# EAGLE design SHIELDV1_NANO (EAGLE 9.5.2)
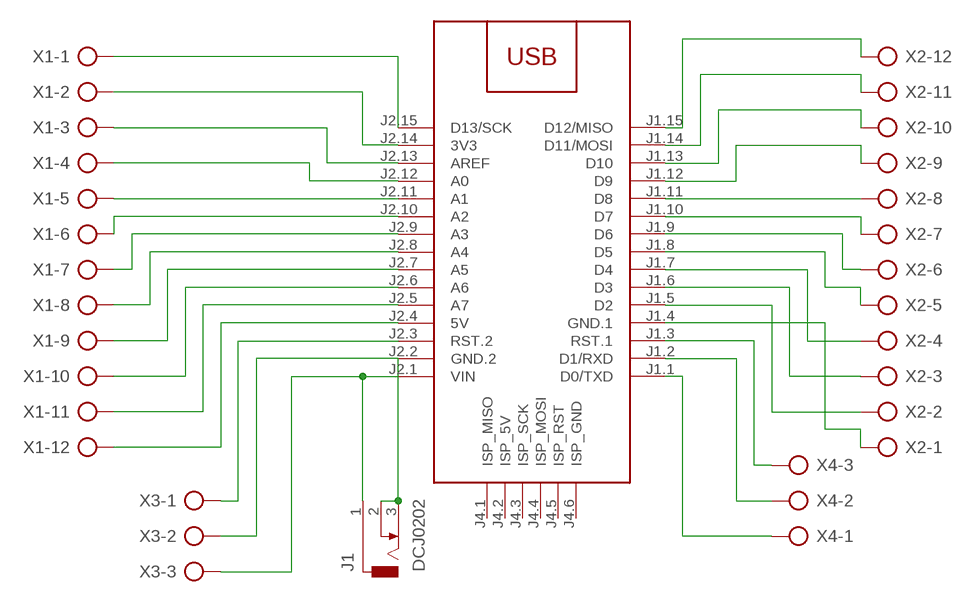
[diagram p0: schematic, sheet 1]

## Parts
J1  DCJ0202  [DCJ0202]
M1  ARDUINO-NANO-3.0#ISP  [ARDUINO-NANO-3.0#ISP]
X1  AK500/12-H  [AK500/12-H]
X2  AK500/12-H  [AK500/12-H]
X3  AK500/3  [AK500/3]
X4  AK500/3  [AK500/3]

## Nets
N$1: M1.J2.15(D13/SCK) X1.1
N$2: M1.J2.14(3V3) X1.2
N$3: M1.J2.13(AREF) X1.3
N$4: M1.J2.12(A0) X1.4
N$5: M1.J2.11(A1) X1.5
N$6: M1.J2.10(A2) X1.6
N$7: M1.J2.9(A3) X1.7
N$8: M1.J2.8(A4) X1.8
N$9: M1.J2.7(A5) X1.9
N$10: M1.J2.6(A6) X1.10
N$11: M1.J2.5(A7) X1.11
N$12: M1.J2.4(5V) X1.12
N$13: M1.J1.15(D12/MISO) X2.12
N$14: M1.J1.14(D11/MOSI) X2.11
N$15: M1.J1.13(D10) X2.10
N$16: M1.J1.12(D9) X2.9
N$17: M1.J1.11(D8) X2.8
N$18: M1.J1.10(D7) X2.7
N$19: M1.J1.9(D6) X2.6
N$20: M1.J1.8(D5) X2.5
N$21: M1.J1.7(D4) X2.4
N$22: M1.J1.6(D3) X2.3
N$23: M1.J1.5(D2) X2.2
N$24: M1.J1.4(GND.1) X2.1
N$25: M1.J2.3(RST.2) X3.1
N$27: J1.1 M1.J2.1(VIN) X3.3
N$28: M1.J1.3(RST.1) X4.3
N$29: M1.J1.2(D1/RXD) X4.2
N$30: M1.J1.1(D0/TXD) X4.1
N$31: J1.2 J1.3 M1.J2.2(GND.2) X3.2
Unconnected: M1.J4.1(ISP_MISO) M1.J4.2(ISP_5V) M1.J4.3(ISP_SCK) M1.J4.4(ISP_MOSI) M1.J4.5(ISP_RST) M1.J4.6(ISP_GND)

## Library data of the parts
J1 = con-jack:DCJ0202: DC POWER JACK Source: DCJ0202.pdf; OC_FARNELL: unknown; OC_NEWARK: unknown
M1 = ARDUINO MODULOS:ARDUINO-NANO-3.0#ISP: Arduino Nano 3.0 with ISP pads
X1 X2 = con-ptr500:AK500/12-H: CONNECTOR Aug. 2004 / PTR Meßtechnik: Die Bezeichnung der Serie AK505 wurde geändert. Es handelt sich hierbei um AK500 in horizontaler Ausführung.; OC_FARNELL: unknown; OC_NEWARK: unknown
X3 X4 = con-ptr500:AK500/3: CONNECTOR; OC_FARNELL: unknown; OC_NEWARK: unknown

## Board
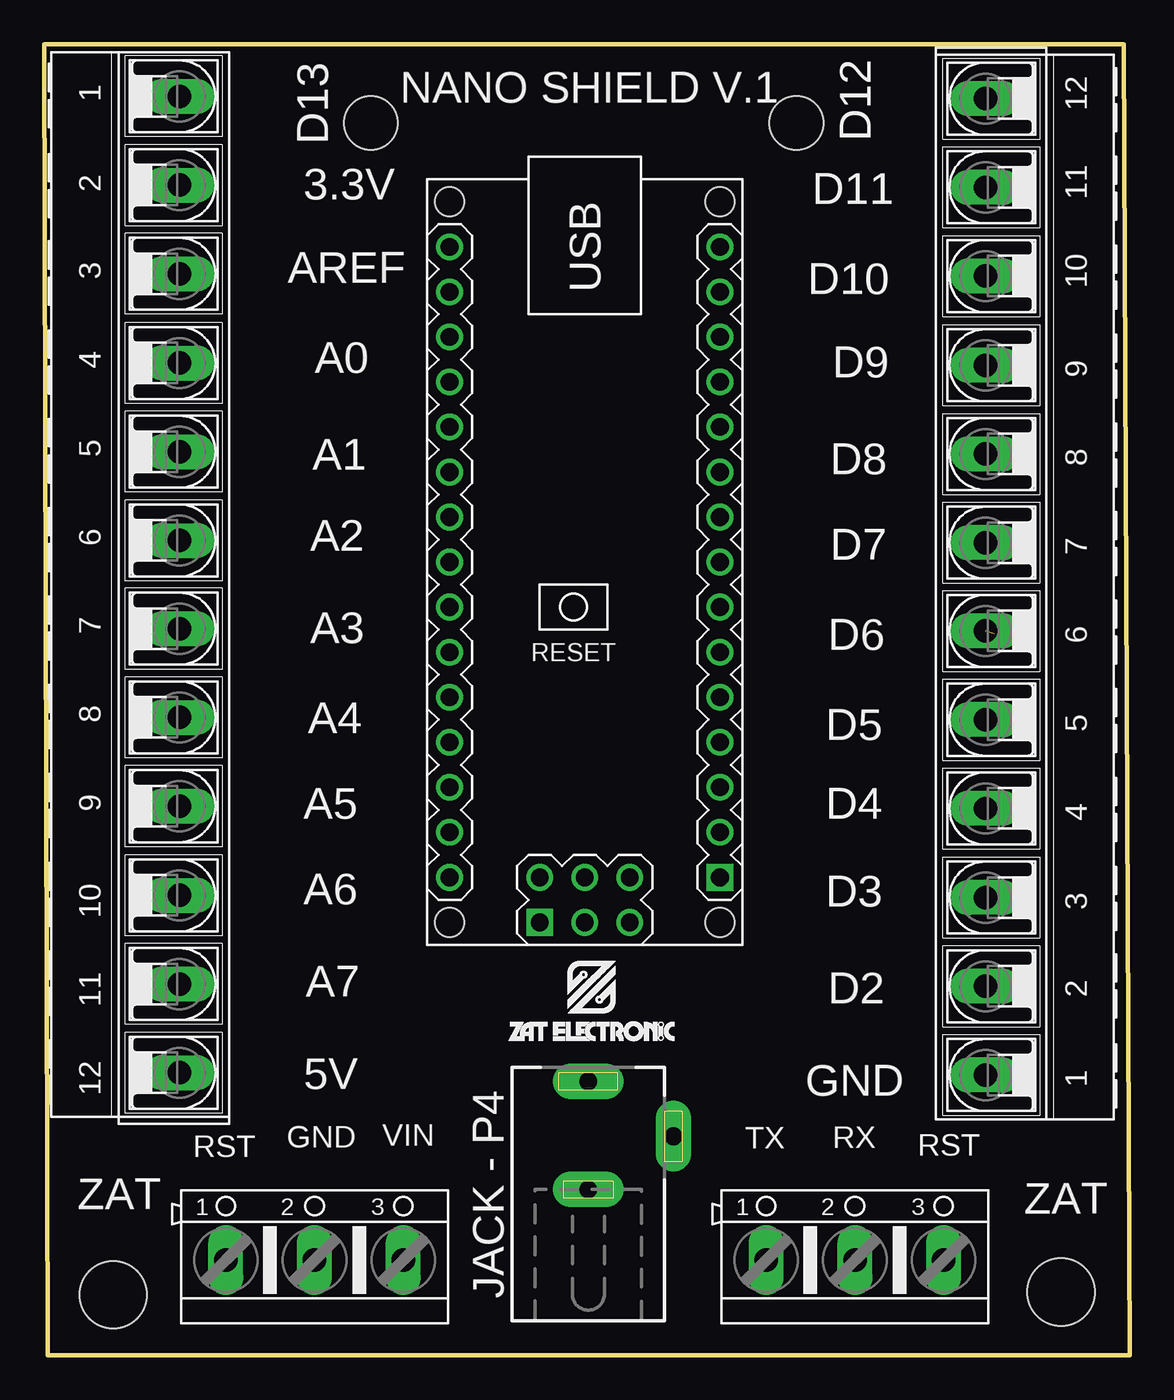
[diagram p1: board, top side]
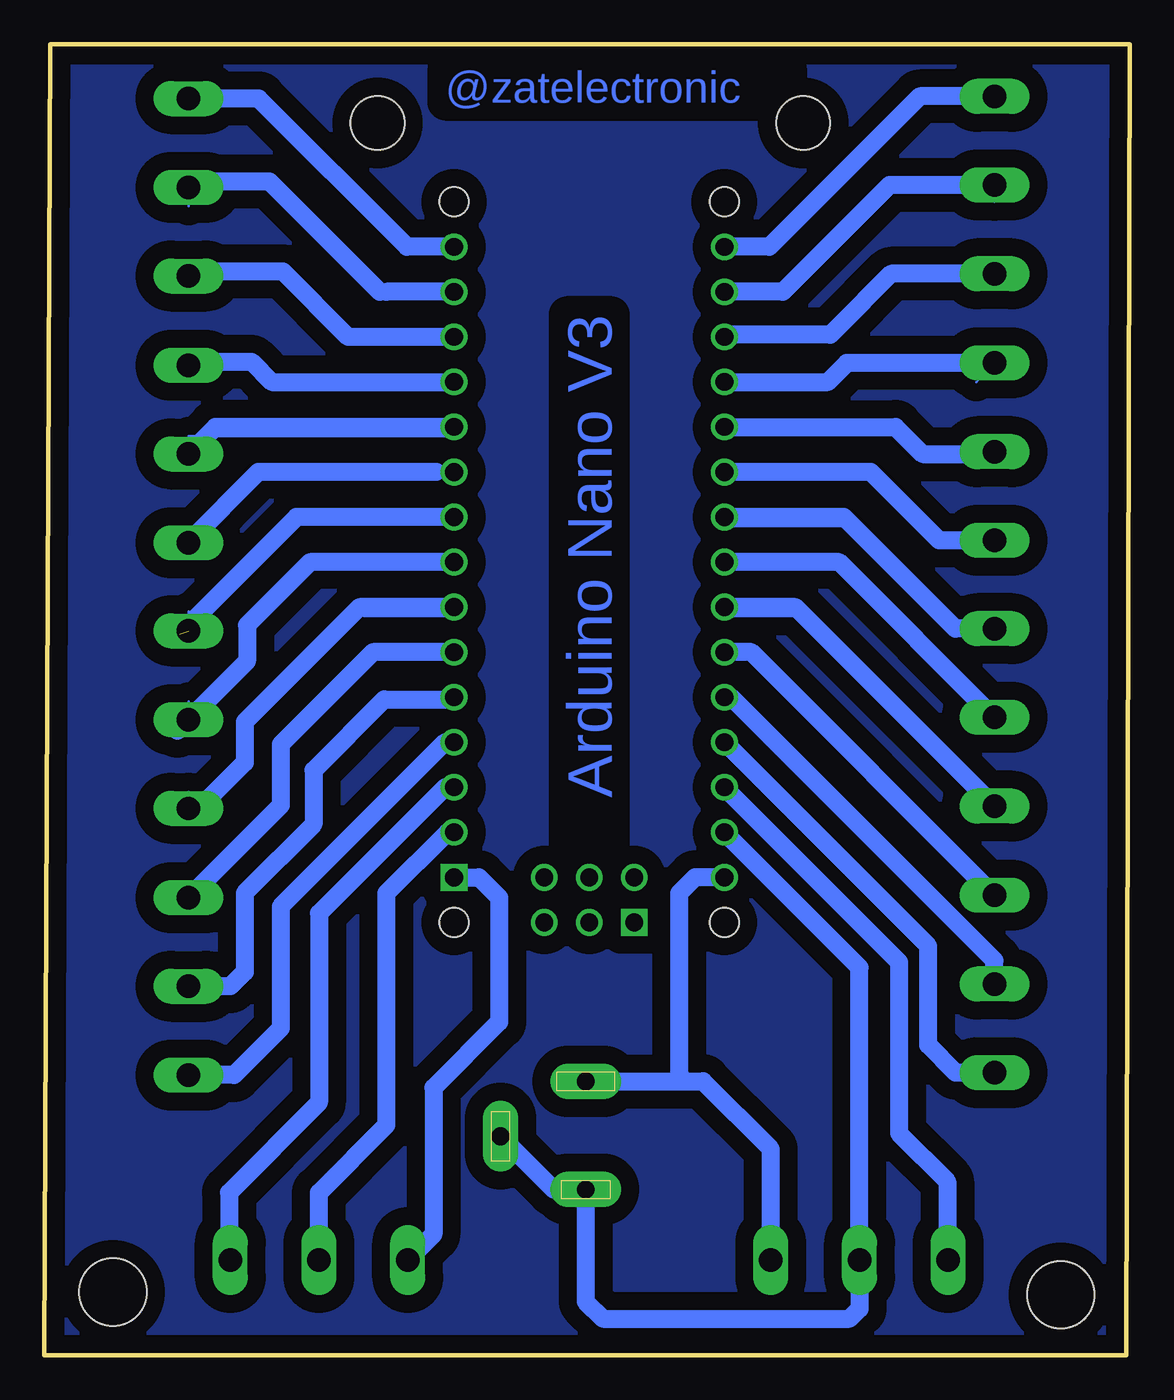
[diagram p2: board, bottom side, seen from below]

Size 61.21 x 73.93 mm. Coordinates in mm from the lower left corner, seen from the top.
Outline: 0.2,0 61.21,0 60.88,73.93 0,73.93 0.2,0
Copper layers (1*16): Top 0.035mm / dielectric 1.5mm / Bottom 0.035mm
Design rules "default": minimum track width 6mil, minimum drill 0.35mm, track to track 6mil, track to pad 6mil, pad to pad 6mil, via to via 6mil, smd to smd 6mil, copper to edge 40mil, drill to drill 6mil, minimum pad ring 10mil, minimum via ring 8mil, stop-mask expansion 4mil, vias tented up to drill 0mil, thermal gap 10mil
Holes 3.81 mm at 3.89,3.4 57.35,3.56
Holes 3.05 mm at 18.41,69.49 42.42,69.49

### Footprints (pad centres in the part's own frame; a part is rotated, then mirrored left to right if it is on the bottom)
DCJ0202 = drill 1 pad 2 long: 1 0,3.1; 2 4.8,0; 3 0,-3
ARDUINO-NANO-3.0#ISP = drill 1 square: J1.1 17.78,7.62; J4.1 20.32,-2.54 | drill 1: J1.2 15.24,7.62; J1.3 12.7,7.62; J1.4 10.16,7.62; J1.5 7.62,7.62; J1.6 5.08,7.62; J1.7 2.54,7.62; J1.8 0,7.62; J1.9 -2.54,7.62; J1.10 -5.08,7.62; J1.11 -7.62,7.62; J1.12 -10.16,7.62; J1.13 -12.7,7.62; J1.14 -15.24,7.62; J1.15 -17.78,7.62; J2.1 17.78,-7.62; J2.2 15.24,-7.62; J2.3 12.7,-7.62; J2.4 10.16,-7.62; J2.5 7.62,-7.62; J2.6 5.08,-7.62; J2.7 2.54,-7.62; J2.8 0,-7.62; J2.9 -2.54,-7.62; J2.10 -5.08,-7.62; J2.11 -7.62,-7.62; J2.12 -10.16,-7.62; J2.13 -12.7,-7.62; J2.14 -15.24,-7.62; J2.15 -17.78,-7.62; J4.2 17.78,-2.54; J4.3 20.32,0; J4.4 17.78,0; J4.5 20.32,2.54; J4.6 17.78,2.54 | hole 1.651: -20.32,7.62; -20.32,-7.62; 20.32,-7.62; 20.32,7.62
AK500/12-H = drill 1.321 long: 1 -27.534,0; 2 -22.53,0; 3 -17.526,0; 4 -12.497,0; 5 -7.493,0; 6 -2.489,0; 7 2.489,0; 8 7.493,0; 9 12.497,0; 10 17.526,0; 11 22.53,0; 12 27.534,0
AK500/3 = drill 1.321 long: 1 -5.004,0; 2 0,0; 3 5.004,0

### Placement (x,y rotation side)
J1  30.68,12.34 0 top
M1  30.48,44.73 270 top
U$1  [LOGO_ESCRITA_PEQUENO]  26.03,17.55 0 top
X1  7.62,43.46 270 top
X2  53.09,43.33 90 top
X3  15.24,5.36 0 top
X4  45.72,5.36 0 top

### Tracks (layer width: path | path; a pad name or v marks a point on that pad's centre or on a via)
GND
  pour Bottom (isolate 1.016): 0.13,73.81 0.13,0.03 61.21,0.03 61.21,73.81
N$1
  Bottom 0.152: 22.86,63.02 M1.J2.15 | 7.62,70.13 X1.1
  Bottom 1.016: M1.J2.15 20.32,62.51 11.84,70.99 X1.1
N$2
  Bottom 0.152: 7.62,65.05 X1.2
  Bottom 1.016: X1.2 13.54,65.99 19.56,59.97 M1.J2.14
N$3
  Bottom 0.152: 16.51,57.94 22.86,57.94 22.86,57.56 M1.J2.13
  Bottom 1.016: X1.3 13.46,60.98 16.51,57.94 16.89,57.56 22.86,57.56
N$4
  Bottom 0.152: 22.73,54.89 M1.J2.12 | 8.64,54.89 7.62,55.91 X1.4
  Bottom 1.016: X1.4 15.95,55.96 17.02,54.89 22.73,54.89
N$5
  Bottom 0.152: 22.86,51.84 M1.J2.11 | 7.62,51.84 X1.5
  Bottom 1.016: M1.J2.11 13.21,52.35 11.68,50.83 7.75,50.83 X1.5
N$6
  Bottom 0.152: 7.62,46.76 X1.6
  Bottom 1.016: X1.6 10.74,45.95 14.6,49.81 M1.J2.10
N$7
  Bottom 0.152: 15.62,46.76 22.86,46.76 M1.J2.9 | 7.62,41.68 X1.7
  Bottom 1.016: X1.7 9.83,40.97 15.62,46.76 16.13,47.27 M1.J2.9
N$8
  Bottom 0.152: M1.J2.8 15.75,44.73 7.62,36.6 X1.8
  Bottom 1.016: X1.8 16.38,44.73 M1.J2.8
N$9
  Bottom 0.152: M1.J2.7 22.86,41.68 17.78,41.68 7.62,31.52 X1.9
  Bottom 1.016: X1.9 18.85,42.19 M1.J2.7
N$10
  Bottom 0.152: M1.J2.6 20.83,39.65 7.62,26.44 X1.10
  Bottom 1.016: X1.10 21.34,39.65 M1.J2.6
N$11
  Bottom 0.152: 22.86,36.6 M1.J2.5
  Bottom 1.016: 7.62,21.36 X1.11 7.62,22.25 22.48,37.11 M1.J2.5
N$12
  Bottom 0.152: 7.62,16.28 X1.12
  Bottom 1.016: X1.12 9.8,15.93 11.37,17.49 11.37,23.08 M1.J2.4
N$13
  Bottom 0.152: 38.1,63.02 M1.J1.15
  Bottom 1.016: X2.12 49.12,70.87 40.77,62.51 M1.J1.15
N$14
  Bottom 0.152: 42.29,59.97 41.91,59.97 | 53.09,64.8 X2.11
  Bottom 1.016: M1.J1.14 41.91,59.97 | 42.29,59.97 48.51,66.19 53.47,66.19 53.14,65.86 X2.11
N$15
  Bottom 0.152: 38.1,57.94 M1.J1.13
  Bottom 1.016: M1.J1.13 44.07,57.43 47.75,61.11 52.83,61.11 X2.10
N$16
  Bottom 0.152: 53.09,55.65 X2.9
  Bottom 1.016: M1.J1.12 48.39,54.89 49.53,56.03 52.32,56.03 52.53,55.83 X2.9
N$17
  Bottom 0.152: M1.J1.11 38.1,51.84 53.09,51.84 X2.8
  Bottom 1.016: M1.J1.11 51.56,52.35 X2.8
N$18
  Bottom 0.152: 39.12,49.81 M1.J1.10 | 53.09,45.87 X2.7
  Bottom 1.016: 39.12,49.81 49.15,49.81 53.09,45.87
N$19  (1 unrouted)
  Bottom 0.152: 38.1,46.76 M1.J1.9 | 53.09,41.94 X2.6
  Bottom 1.016: M1.J1.9 46.99,47.27 53.59,40.66
N$20
  Bottom 0.152: 53.09,36.85 X2.5
  Bottom 1.016: M1.J1.8 46.23,44.73 49.78,41.17 49.78,39.14 X2.5 53.72,35.2
N$21
  Bottom 0.152: 43.18,41.68 38.1,41.68 M1.J1.7 | 53.09,31.77 53.09,30.89 X2.4
  Bottom 1.016: M1.J1.7 43.43,42.19 49.91,35.71 49.91,33.43 52.45,30.89 53.09,30.89
N$22
  Bottom 0.152: 53.09,26.7 X2.3
  Bottom 1.016: M1.J1.6 42.67,39.65 47.88,34.44 47.88,31.01 X2.3
N$23
  Bottom 0.152: 38.1,36.6 M1.J1.5
  Bottom 1.016: M1.J1.5 38.23,36.98 42.04,36.98 46.04,32.98 46.04,29.93 49.91,26.06 49.91,21.62 50.72,20.8 X2.2
N$24
  Bottom 0.152: 53.09,16.54 X2.1
  Bottom 0.508: 52.45,15.8 X2.1 | 47.88,18.44 47.94,18.38
  Bottom 1.016: M1.J1.4 38.61,34.57 47.88,25.3 47.88,18.44 | 47.94,18.38 50.52,15.8 52.45,15.8
N$25
  Bottom 0.152: 22.86,31.52 M1.J2.3 | X3.1 10.29,5.36
  Bottom 1.016: 10.29,5.36 10.29,9.8 13,12.52 13,22.17 M1.J2.3
N$27
  Bottom 1.016: M1.J2.1 24.51,26.95 25.4,26.06 25.4,15.77 25.07,15.44 | X3.3 20.24,11.63 24.05,15.44 25.07,15.44 | J1.1 25.07,15.44
N$28
  Bottom 0.152: 38.1,31.52 M1.J1.3 | 51.31,5.36 50.8,5.36 X4.3
  Bottom 1.016: M1.J1.3 38.61,32.03 45.72,24.92 45.72,14.25 50.8,9.17 50.8,5.36
N$29
  Bottom 0.152: 39.12,28.47 M1.J1.2 | 46.23,5.36 X4.2
  Bottom 1.016: M1.J1.2 38.48,29.49 41.91,26.06 41.91,12.98 45.72,9.17 X4.2
N$30
  Bottom 0.152: 38.1,26.44 M1.J1.1
  Bottom 1.016: M1.J1.1 36.7,26.95 35.56,25.81 35.56,18.8 39.27,15.09 39.27,6.81 X4.1
N$31
  Bottom 0.152: 15.75,4.85 X3.2
  Bottom 1.016: M1.J2.2 15.24,21.87 X3.2 15.24,2.62 15.8,2.06 29.72,2.06 30.68,3.02 J1.3 32.48,9.34 J1.2

### Text on the board
Bottom: @zatelectronic | Arduino Nano V3
tNames: D13 | NANO SHIELD V.1 | D12 | 3.3V | D11 | AREF | D10 | A0 | D9 | A1 | D8 | A2 | D7 | A3 | D6 | A4 | D5 | A5 | D4 | A6 | D3 | A7 | D2 | 5V | GND | GND | VIN | TX | RX | RST | RST | ZAT | ZAT | JACK - P4